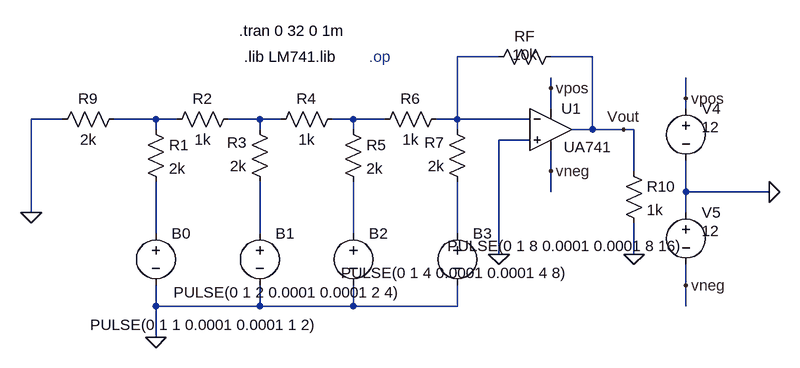
[diagram p0: schematic DACR2R.asc]
DACR2R.asc, the LTspice schematic file:
Version 4.1
SHEET 1 1028 680
WIRE 592 0 528 0
WIRE 736 0 672 0
WIRE 672 48 672 32
WIRE 880 64 880 32
WIRE 672 80 672 48
WIRE 880 80 880 64
WIRE -80 96 -128 96
WIRE 64 96 0 96
WIRE 96 96 64 96
WIRE 224 96 176 96
WIRE 256 96 224 96
WIRE 368 96 336 96
WIRE 416 96 368 96
WIRE 528 96 528 0
WIRE 528 96 496 96
WIRE 640 96 528 96
WIRE 64 112 64 96
WIRE 224 112 224 96
WIRE 368 112 368 96
WIRE 528 112 528 96
WIRE 736 112 736 0
WIRE 736 112 704 112
WIRE 784 112 736 112
WIRE 800 112 784 112
WIRE 640 128 592 128
WIRE 672 176 672 144
WIRE 800 176 800 112
WIRE 672 208 672 176
WIRE 880 208 880 160
WIRE 1008 208 880 208
WIRE -128 240 -128 96
WIRE 880 240 880 208
WIRE 64 272 64 192
WIRE 224 272 224 192
WIRE 368 272 368 192
WIRE 528 272 528 192
WIRE 592 304 592 128
WIRE 800 304 800 256
WIRE 880 352 880 320
WIRE 64 384 64 352
WIRE 224 384 224 352
WIRE 224 384 64 384
WIRE 368 384 368 352
WIRE 368 384 224 384
WIRE 528 384 528 352
WIRE 528 384 368 384
WIRE 880 384 880 352
WIRE 64 432 64 384
FLAG 592 304 0
FLAG 1008 208 0
FLAG -128 240 0
FLAG 64 432 0
FLAG 800 304 0
FLAG 784 112 Vout
FLAG 672 48 vpos
FLAG 672 176 vneg
FLAG 880 352 vneg
FLAG 880 64 vpos
SYMBOL res 48 96 R0
SYMATTR InstName R1
SYMATTR Value 2k
SYMBOL res 192 80 R90
WINDOW 0 0 56 VBottom 2
WINDOW 3 32 56 VTop 2
SYMATTR InstName R2
SYMATTR Value 1k
SYMBOL res 240 208 R180
WINDOW 0 36 76 Left 2
WINDOW 3 36 40 Left 2
SYMATTR InstName R3
SYMATTR Value 2k
SYMBOL res 240 112 R270
WINDOW 0 32 56 VTop 2
WINDOW 3 0 56 VBottom 2
SYMATTR InstName R4
SYMATTR Value 1k
SYMBOL res 352 96 R0
SYMATTR InstName R5
SYMATTR Value 2k
SYMBOL res 512 80 R90
WINDOW 0 0 56 VBottom 2
WINDOW 3 32 56 VTop 2
SYMATTR InstName R6
SYMATTR Value 1k
SYMBOL res 544 208 R180
WINDOW 0 36 76 Left 2
WINDOW 3 36 40 Left 2
SYMATTR InstName R7
SYMATTR Value 2k
SYMBOL voltage 880 64 R0
WINDOW 123 0 0 Left 0
WINDOW 39 0 0 Left 0
WINDOW 3 24 44 Left 2
SYMATTR Value 12
SYMATTR InstName V4
SYMBOL OpAmps\\opamp2 672 48 R0
WINDOW 3 20 91 Left 2
SYMATTR Value UA741
SYMATTR InstName U1
SYMBOL res 688 -16 R90
WINDOW 0 0 56 VBottom 2
WINDOW 3 28 56 VBottom 2
SYMATTR InstName RF
SYMATTR Value 10k
SYMBOL res 16 80 R90
WINDOW 0 0 56 VBottom 2
WINDOW 3 32 56 VTop 2
SYMATTR InstName R9
SYMATTR Value 2k
SYMBOL voltage 64 256 R0
WINDOW 123 0 0 Left 0
WINDOW 39 0 0 Left 0
WINDOW 3 -101 157 Left 2
SYMATTR Value PULSE(0 1 1 0.0001 0.0001 1 2)
SYMATTR InstName B0
SYMBOL voltage 224 256 R0
WINDOW 123 0 0 Left 0
WINDOW 39 0 0 Left 0
WINDOW 3 -133 107 Left 2
SYMATTR Value PULSE(0 1 2 0.0001 0.0001 2 4)
SYMATTR InstName B1
SYMBOL voltage 368 256 R0
WINDOW 123 0 0 Left 0
WINDOW 39 0 0 Left 0
WINDOW 3 -19 77 Left 2
SYMATTR Value PULSE(0 1 4 0.0001 0.0001 4 8)
SYMATTR InstName B2
SYMBOL voltage 528 256 R0
WINDOW 123 0 0 Left 0
WINDOW 39 0 0 Left 0
WINDOW 3 -15 35 Left 2
SYMATTR Value PULSE(0 1 8 0.0001 0.0001 8 16)
SYMATTR InstName B3
SYMBOL res 784 160 R0
SYMATTR InstName R10
SYMATTR Value 1k
SYMBOL voltage 880 224 R0
WINDOW 123 0 0 Left 0
WINDOW 39 0 0 Left 0
WINDOW 3 24 44 Left 2
SYMATTR Value 12
SYMATTR InstName V5
TEXT 200 0 Left 2 !.lib LM741.lib
TEXT 392 0 Left 2 ;.op
TEXT 192 -40 Left 2 !.tran 0 32 0 1m

The netlist it stands for:
* DACR2R.asc
R1 N002 N005 2k
R2 N003 N002 1k
R3 N006 N003 2k
R4 N003 N004 1k
R5 N004 N007 2k
R6 N001 N004 1k
R7 N008 N001 2k
V4 vpos 0 12
X§U1 0 N001 vpos vneg Vout UA741  ; pins In+ In- V+ V- OUT
RF Vout N001 10k
R9 N002 0 2k
V§B0 N005 0 PULSE(0 1 1 0.0001 0.0001 1 2)
V§B1 N006 0 PULSE(0 1 2 0.0001 0.0001 2 4)
V§B2 N007 0 PULSE(0 1 4 0.0001 0.0001 4 8)
V§B3 N008 0 PULSE(0 1 8 0.0001 0.0001 8 16)
R10 Vout 0 1k
V5 0 vneg 12
.lib LM741.lib
* .op
.tran 0 32 0 1m
.backanno
.end